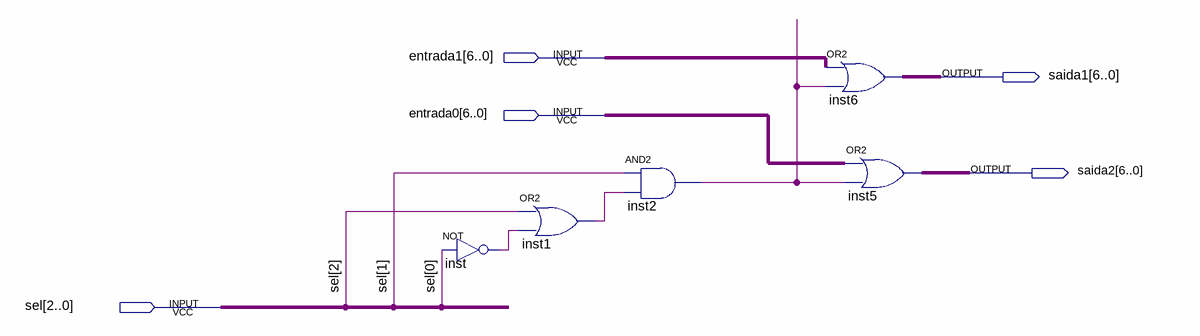
[diagram p0: schematic sheet]
// Quartus schematic display_enable_entrada.bdf as structural Verilog: 5 symbols, 5 pins
module display_enable_entrada (
  input  [6:0] entrada1,
  input  [6:0] entrada0,
  input  [2:0] sel,
  output [6:0] saida1,
  output [6:0] saida2
);

  wire inst1_out, inst2_out, inst_out;

  not inst (inst_out, sel[0]);
  or inst1 (inst1_out, sel[2], inst_out);
  and inst2 (inst2_out, sel[1], inst1_out);
  assign saida1 = entrada1 | {7{inst2_out}};  // OR2 inst6, 7 bits wide
  assign saida2 = entrada0 | {7{inst2_out}};  // OR2 inst5, 7 bits wide
endmodule
